# EAGLE design SparkFun HX711 Load Cell (EAGLE 7.5.0)
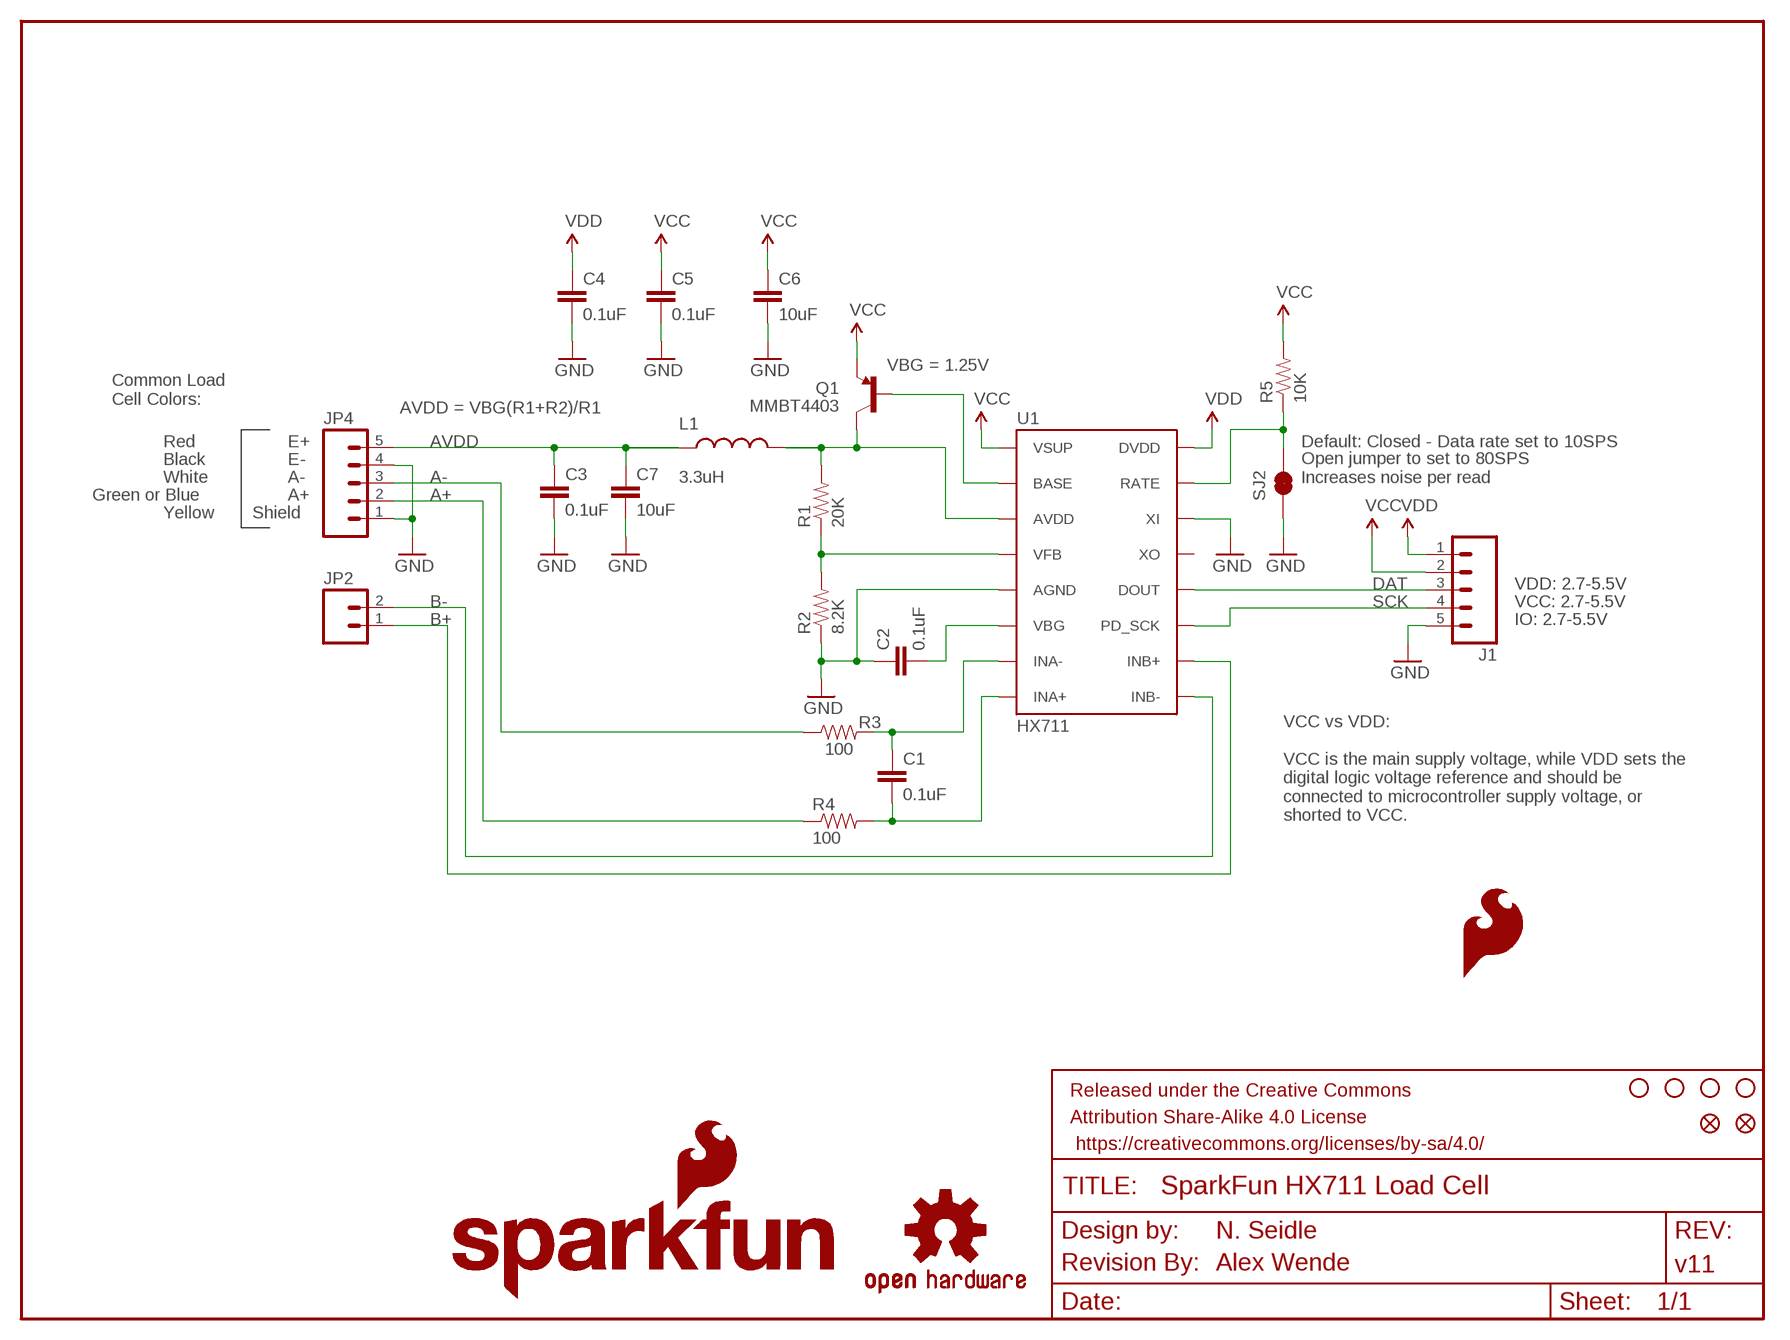
[diagram p0: schematic, sheet 1]

## Parts
C1  0.1uF  0.1UF-25V-5%(0603)  [0603-CAP]
C2  0.1uF  0.1UF-25V-5%(0603)  [0603-CAP]
C3  0.1uF  0.1UF-25V-5%(0603)  [0603-CAP]
C4  0.1uF  0.1UF-25V-5%(0603)  [0603-CAP]
C5  0.1uF  0.1UF-25V-5%(0603)  [0603-CAP]
C6  10uF  10UF50V20%(1210)  [1210]
C7  10uF  10UF50V20%(1210)  [1210]
FID1  FIDUCIAL1X2  [FIDUCIAL-1X2]
FID2  FIDUCIAL1X2  [FIDUCIAL-1X2]
FRAME1  FRAME-LETTER  [CREATIVE_COMMONS]
J1  M05PTH  [1X05]
JP2  M02PTH  [1X02]
JP4  M05PTH  [1X05]
L1  3.3uH  INDUCTOR0805-IND  [0805]
LOGO1  SFE_LOGO_NAME_FLAME.1_INCH  [SFE_LOGO_NAME_FLAME_.1]
LOGO3  SFE_LOGO_FLAME.1_INCH  [SFE_LOGO_FLAME_.1]
Q1  MMBT4403  TRANSISTOR_PNPMMBT4403  [SOT23-3]
R1  20K  20KOHM1/10W1%(0603)  [0603-RES]
R2  8.2K  8.2KOHM-1/10W-5%(0603)  [0603-RES]
R3  100  100OHM-1/10W-1%(0603)  [0603-RES]
R4  100  100OHM-1/10W-1%(0603)  [0603-RES]
R5  10K  10KOHM-1/10W-1%(0603)0603  [0603-RES]
SJ2  JUMPER-PAD-2-NC_BY_TRACE  [PAD-JUMPER-2-NC_BY_TRACE_YES_SILK]
STANDOFF1  STAND-OFF  [STAND-OFF]
STANDOFF2  STAND-OFF  [STAND-OFF]
STANDOFF3  STAND-OFF  [STAND-OFF]
STANDOFF4  STAND-OFF  [STAND-OFF]
U1  HX711  HX711HX711  [SO16]
U7  OSHW-LOGOS  [OSHW-LOGO-S]
U$1  REVISION  [REVISION]

## Nets
A+: JP4.2 R4.1
A-: JP4.3 R3.1
AVDD: C3.1 C7.1 JP4.5 L1.1
B+: JP2.1 U1.10(INB+)
B-: JP2.2 U1.9(INB-)
DAT: J1.3 U1.12(DOUT)
GND: C2.1 C3.2 C4.2 C5.2 C6.2 C7.2 J1.5 JP4.1 JP4.4 R2.1 SJ2.1 U1.5(AGND) U1.14(XI)
N$1: R5.1 SJ2.2 U1.15(RATE)
N$2: C1.1 R3.2 U1.7(INA-)
N$3: C1.2 R4.2 U1.8(INA+)
N$4: Q1.1(B) U1.2(BASE)
N$5: L1.2 Q1.3(C) R1.2 U1.3(AVDD)
N$6: R1.1 R2.2 U1.4(VFB)
N$7: C2.2 U1.6(VBG)
SCK: J1.4 U1.11(PD_SCK)
VCC: C5.1 C6.1 J1.2 Q1.2(E) R5.2 U1.1(VSUP)
VDD: C4.1 J1.1 U1.16(DVDD)
Unconnected: U1.13(XO)

## Notes on the sheet
- VBG = 1.25V
- Common Load
  Cell Colors:
- AVDD = VBG(R1+R2)/R1
- Red | E+ | Default: Closed - Data rate set to 10SPS
- Black | E-
- White | A-
- Open jumper to set to 80SPS
  Increases noise per read
- Green or Blue | A+
- Yellow | Shield
- VDD: 2.7-5.5V
- VCC: 2.7-5.5V
- IO: 2.7-5.5V
- VCC vs VDD:
  
  VCC is the main supply voltage, while VDD sets the
  digital logic voltage reference and should be
  connected to microcontroller supply voltage, or
  shorted to VCC.
- Alex Wende

## Library data of the parts
C1-C5 = SparkFun-Capacitors:0.1UF-25V-5%(0603): CAP-08604; PROD_ID: CAP-08604
C6 C7 = SparkFun-Capacitors:10UF50V20%(1210): CAP-09824; PROD_ID: CAP-09824
FID1 FID2 = SparkFun-Aesthetics:FIDUCIAL: Fiducial Alignment Points Various fiducial points for machine vision alignment.
FRAME1 = SparkFun-Aesthetics:FRAME-LETTER: Schematic Frame Standard 8.5x11 US Letter frame; DESIGNER: N. Seidle; VERSION: v11
J1 JP4 = SparkFun-Connectors:M05: Header 5 Standard 5-pin 0.1" header. Use with straight break away headers (SKU : PRT-00116), right angle break away headers (PRT-00553), swiss pins (PRT-00743), machine pins (PRT-00117), and female headers (PRT-00115). Molex polarized connector foot print use with SKU : PRT-08230 with associated crimp pins and housings.
JP2 = SparkFun-Connectors:M02: Standard 2-pin 0.1" header. Use with - straight break away headers ( PRT-00116) - right angle break away headers (PRT-00553) - swiss pins (PRT-00743) - machine pins (PRT-00117) - female headers (PRT-00115) Molex polarized connector foot print use with: PRT-08233 with associated crimp pins and housings. 2.54_SCREWTERM for use with PRT-10571. 3.5mm Screw Terminal footprints for PRT-08084 5mm Screw Terminal footprints for use with PRT-08432
L1 = SparkFun-Passives:INDUCTOR: Inductors Basic Inductor/Choke - 0603 and 1206. Footprints are not proven and vary greatly between part numbers. INDUCTOR POWER 3.3UH 4.0A SMD 0.197" L x 0.197" W x 0.177" H (5.00mm x 5.00mm x 4.50mm); PROD_ID: NDUC-13076
LOGO1 = SparkFun-Aesthetics:SFE_LOGO_NAME_FLAME: SFE Logo, name and flame This is the SparkFun full logo. The logo on the schematic will always be the same size; the package variant is the height of the flame part of the logo. Default layer for the logo on the board is tSilk.
LOGO3 = SparkFun-Aesthetics:SFE_LOGO_FLAME: SFE Logo, flame only This is the SparkFun flame logo. The logo on the schematic will always be the same size; the package variant is the height of the flame. Default layer for the logo on the board is tSilk.
Q1 = SparkFun-DiscreteSemi:TRANSISTOR_PNP: Generic PNP BJT Double check pinouts against datasheets- not all devices are the same! MMBT3906 - 40V 200mA SOT-23 (TRANS-08052) MMBT4403 - 40V 600mA SOT-23 (TRANS-09245); PROD_ID: TRANS-09245
R1 = SparkFun-Resistors:20KOHM1/10W1%(0603): RES-09383; PROD_ID: RES-09383; VALUE: 20k
R2 = SparkFun-Resistors:8.2KOHM-1/10W-5%(0603): RES-10646; PROD_ID: RES-10646
R3 R4 = SparkFun-Resistors:100OHM-1/10W-1%(0603): RES-07863; PROD_ID: RES-07863
R5 = SparkFun-Resistors:10KOHM-1/10W-1%(0603): RES-00824; PROD_ID: RES-00824
SJ2 = SparkFun-Passives:JUMPER-PAD-2-NC_BY_TRACE
STANDOFF1-STANDOFF4 = SparkFun-Electromechanical:STAND-OFF: #4 Stand Off This is the mechanical footprint for a #4 phillips button head screw. Use the keepout ring to avoid running the screw head into surrounding components. SKU : PRT-00447
U1 = Testing:HX711; PROD_ID: IC-12445
U7 = SparkFun-Aesthetics:OSHW-LOGO: Open Source Hardware Logo This logo indicates the piece of hardware it is found on incorporates a OSHW license and/or adheres to the definition of open source hardware found here: http://freedomdefined.org/OSHW
U$1 = SparkFun-Aesthetics:REVISION

## Board
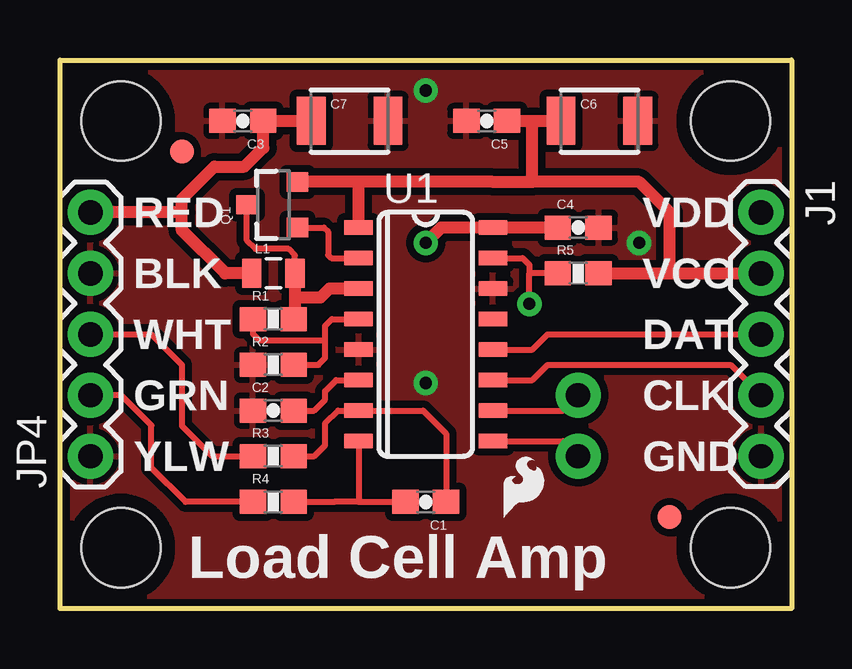
[diagram p1: board, top side]
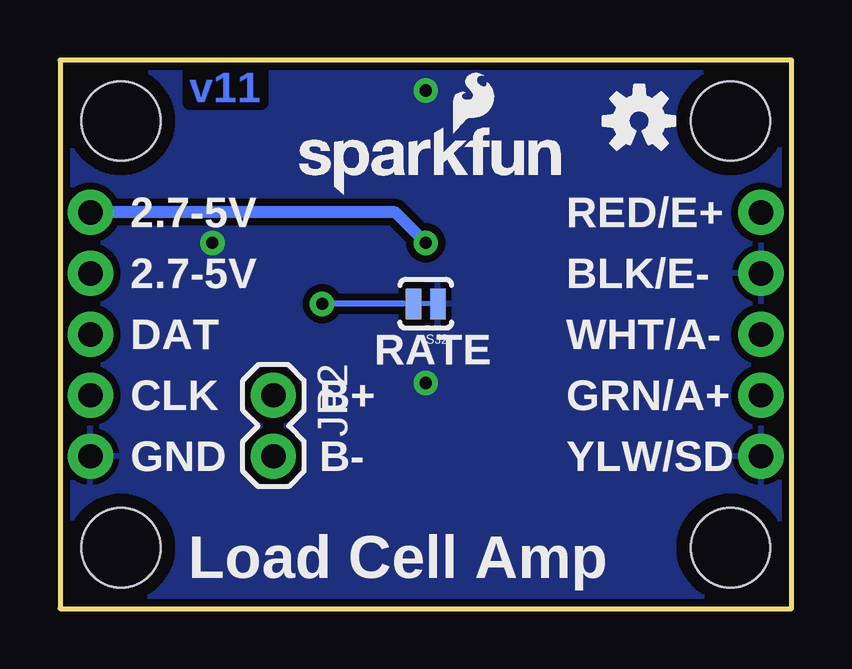
[diagram p2: board, bottom side, seen from below]

Size 30.48 x 22.86 mm. Coordinates in mm from the lower left corner, seen from the top.
Outline: 0,22.86 30.48,22.86 30.48,0 0,0 0,22.86
Copper layers (1*16): Top 0.035mm / dielectric 1.5mm / Bottom 0.035mm
Design rules "SparkFun-2-layer-STANDARD": minimum track width 10mil, minimum drill 20mil, track to track 10mil, track to pad 8mil, pad to pad 8mil, via to via 10mil, smd to smd 8mil, copper to edge 8mil, drill to drill 8mil, minimum pad ring 10mil, minimum via ring 10mil, stop-mask expansion 4mil, vias tented up to drill 25mil, thermal gap 10mil

### Footprints (pad centres in the part's own frame; a part is rotated, then mirrored left to right if it is on the bottom)
0603-CAP = smd 1.1 x 1: 1 -0.85,0; 2 0.85,0
1210 = smd 1.2 x 2: 1 -1.6,0; 2 1.6,0
FIDUCIAL-1X2 = smd 1 x 1: 1 0,0
1X05 = drill 1.016 pad 1.88: 1 0,0; 2 2.54,0; 3 5.08,0; 4 7.62,0; 5 10.16,0
1X02 = drill 1.016 pad 1.88: 1 0,0; 2 2.54,0
0805 = smd 0.8 x 1.2: 1 -0.9,0; 2 0.9,0
SOT23-3 = smd 0.8 x 0.9: 1 -0.95,-1; 2 0.95,-1; 3 0,1.1
0603-RES = smd 1.1 x 1: 1 -0.85,0; 2 0.85,0
PAD-JUMPER-2-NC_BY_TRACE_YES_SILK = smd 0.635 x 1.27: 1 -0.508,0; 2 0.508,0
STAND-OFF = hole 3.302: 0,0
SO16 = smd 0.6 x 1.2: 1 -4.445,-2.8; 2 -3.175,-2.8; 3 -1.905,-2.8; 4 -0.635,-2.8; 5 0.635,-2.8; 6 1.905,-2.8; 7 3.175,-2.8; 8 4.445,-2.8; 9 4.445,2.8; 10 3.175,2.8; 11 1.905,2.8; 12 0.635,2.8; 13 -0.635,2.8; 14 -1.905,2.8; 15 -3.175,2.8; 16 -4.445,2.8

### Placement (x,y rotation side)
C1  15.24,4.45 180 top
C2  8.89,8.26 0 top
C3  7.62,20.32 180 top
C4  21.59,15.88 0 top
C5  17.78,20.32 180 top
C6  22.48,20.32 0 top
C7  12.06,20.32 0 top
FID1  5.08,19.05 0 top
FID2  25.4,3.81 0 top
FRAME1  -5.08,-19.05 0 top  (outside the outline)
J1  29.21,16.51 270 top
JP2  21.59,8.89 270 bottom
JP4  1.27,6.35 90 top
L1  8.89,13.97 0 top
LOGO1  20.95,17.14 0 bottom
LOGO3  18.16,3.43 0 top
Q1  8.89,16.83 90 top
R1  8.89,12.06 0 top
R2  8.89,10.16 0 top
R3  8.89,6.35 0 top
R4  8.89,4.45 0 top
R5  21.59,13.97 0 top
SJ2  15.24,12.7 180 bottom
STANDOFF1  2.54,2.54 0 top
STANDOFF2  27.94,2.54 0 top
STANDOFF3  2.54,20.32 0 top
STANDOFF4  27.94,20.32 0 top
U1  15.24,11.43 270 top
U7  6.35,20.32 0 bottom
U$1  3.17,-22.86 0 top  (outside the outline)

### Tracks (layer width: path | path; a pad name or v marks a point on that pad's centre or on a via)
A+
  Top 0.254: R4.1 5.23,4.45 3.81,5.87 3.81,7.63 2.55,8.89 JP4.2
A-
  Top 0.254: JP4.3 3.81,11.43 5.08,10.16 5.08,7.62 6.35,6.35 R3.1
AVDD
  Top 0.508: L1.1 6.88,13.97 5.08,15.77 5.08,16.51 | 5.08,16.51 JP4.5 | C7.1 C3.1 8.47,19.2 7.69,18.41 6.43,18.41 5.08,17.07 5.08,16.51
B+
  Top 0.254: U1.10 20.95,8.26 JP2.1
B-
  Top 0.254: U1.9 20.95,6.99 JP2.2
DAT
  Top 0.254: U1.12 19.68,10.79 20.32,11.43 J1.3
GND  (via drill 0.51)
  other vias: 15.24,9.4 24.13,15.24 15.24,21.59
  pour Top (isolate 0.305): 0,22.86 0,0 30.48,0 30.48,22.86
  pour Bottom (isolate 0.305): 0,22.86 0,0 30.48,0 30.48,22.86
N$1  (via drill 0.51)
  Top 0.254: U1.15 19.27,14.61 19.56,14.32 19.56,13.97 | R5.1 19.56,13.97 | v19.56,12.7 19.56,13.97
  Bottom 0.254: SJ2.2 v19.56,12.7
N$2
  Top 0.254: C1.1 16.09,7.29 15.13,8.26 U1.7 11.59,8.26 11.05,7.72 11.05,6.81 10.59,6.35 R3.2
N$3
  Top 0.254: R4.2 11.43,4.45 12.44,4.45 | 12.44,4.45 C1.2 | U1.8 12.44,4.45
N$4
  Top 0.254: Q1.1 10.99,15.88 11.18,15.7 11.18,14.73 11.3,14.61 U1.2
N$5
  Top 0.254: L1.2 9.79,14.72 9.53,14.99 8.15,14.99 7.79,15.35 Q1.3
  Top 0.508: L1.2 9.79,12.95 | 9.79,12.95 9.79,12.06 R1.2 | U1.3 11.23,13.34 10.85,12.95 9.79,12.95
N$6
  Top 0.254: R2.2 10.77,10.16 11.05,10.44 11.05,11.18 | 11.05,11.18 11.05,11.78 11.33,12.06 U1.4 | R1.1 8.04,11.45 8.31,11.18 11.05,11.18
N$7
  Top 0.254: C2.2 10.59,8.26 11.05,8.71 11.05,9.07 11.51,9.53 U1.6
SCK
  Top 0.254: U1.11 19.68,9.53 20.32,10.16 27.94,10.16 J1.4
VCC
  Top 0.508: 18.03,17.78 12.44,17.78 | 12.44,17.78 Q1.2 | 18.04,17.77 18.03,17.78 | 19.68,17.78 24.13,17.78 25.4,16.51 25.4,13.97 | 25.4,13.97 J1.2 | U1.1 12.44,17.78 | C5.1 19.68,20.32 | 19.68,20.32 C6.1 | R5.2 25.4,13.97 | 18.03,17.78 19.68,17.78 | 19.68,17.78 19.68,20.32
VDD  (via drill 0.51)
  Top 0.508: U1.16 C4.1 15.88,15.88 v15.24,15.24
  Bottom 0.508: v15.24,15.24 16.51,16.51 J1.1

### Text on the board
tPlace: RED | VDD | BLK | VCC | WHT | DAT | GRN | CLK | YLW | GND | Load Cell Amp
bPlace: RED/E+ | 2.7-5V | BLK/E- | 2.7-5V | WHT/A- | DAT | RATE | GRN/A+ | B+ | CLK | YLW/SD | B- | GND | Load Cell Amp
Measures: Units are in inches
tDocu: Alex Wende